# Altium schematic sheet ALL.schdoc
size 274 x 127 mm
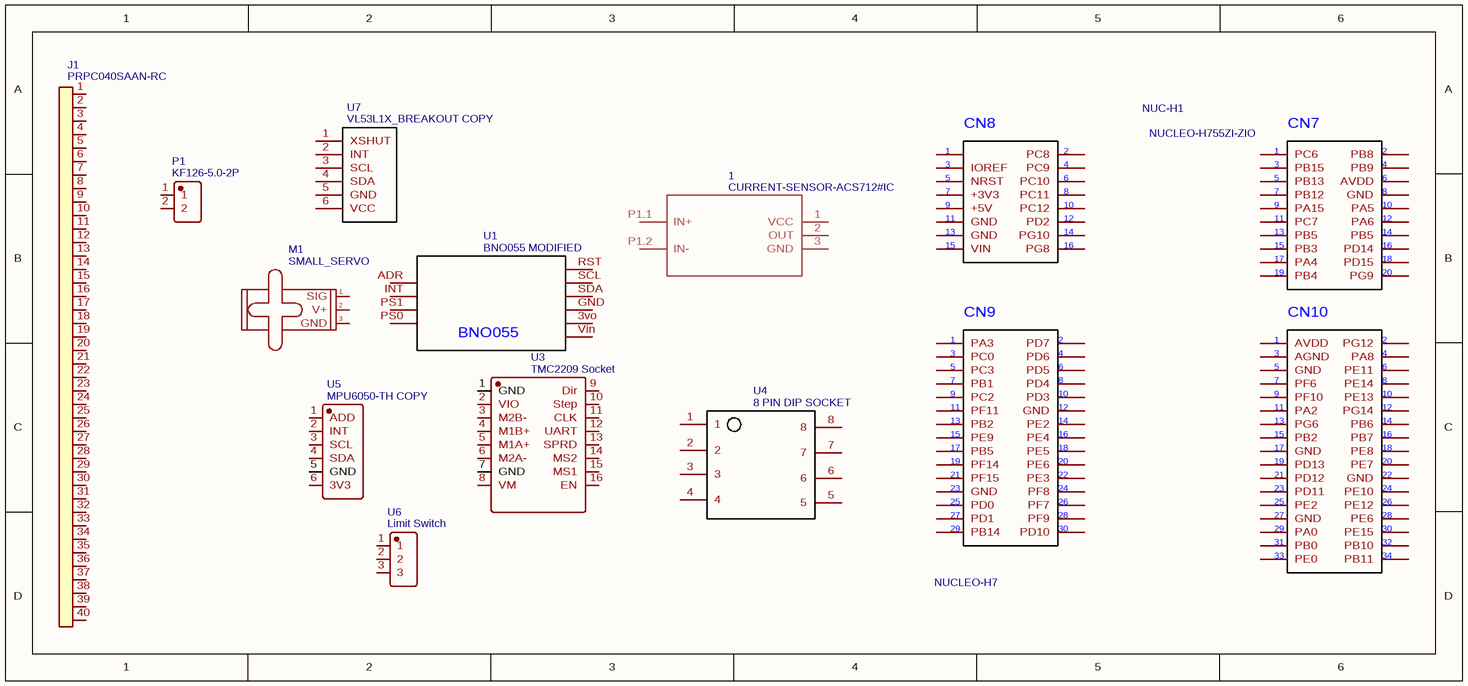
[diagram p0: ALL.schdoc]

## Parts
1  CURRENT-SENSOR-ACS712#IC  [CURRENT-SENSOR-ACS712#IC]
J1  PRPC040SAAN-RC  [PINHEADER_1X40_P2.54_DRILL1MM]
M1  SMALL_SERVO  [1X03]
NUC-H1  NUCLEO-H755ZI-ZIO  [NUCLEO-H7]
P1  KF126-5.0-2P  [CONN-TH_P5.00_KF126-5.0-2P]
U1  BNO055 MODIFIED  [BNO055]
U3  TMC2209 Socket  [COMM-TH_TMC2209SILENTSTEPSTICK]
U4  8 PIN DIP SOCKET  [DIP 8 PIN SOCKET]
U5  MPU6050-TH COPY  [COMM-TH_MPU6050-TH]
U6  Limit Switch  [CONN-TH_3P-P5.00_KF126-5.0-3P]
U7  VL53L1X_BREAKOUT COPY  [VL53L1X_BREAKOUT]

## Nets

Not connected (* = marked no-connect by the designer): 1 1(VCC) 2(OUT) 3(GND) P1.1(IN+) P1.2(IN-); J1 1 2 3 4 5 6 7 8 9 10 11 12 13 14 15 16 17 18 19 20 21 22 23 24 25 26 27 28 29 30 31 32 33 34 35 36 37 38 39 40; M1 1(SIG) 2(V+) 3(GND); NUC-H1 145(PC10) 146(PC8) 147(IOREF) 148(PC9) 149(NRST) 150(PC10) 151(+3V3) 152(PC11) 153(+5V) 154(PC12) 155(GND) 156(PD2) 157(GND) 158(PG10) 159(VIN) 160(PG8) 161(PA3) 162(PD7) 163(PC0) 164(PD6) 165(PC3) 166(PD5) 167(PB1) 168(PD4) 169(PC2) 170(PD3) 171(PF11) 172(GND) 173(PB2) 174(PE2) 175(PE9) 176(PE4) 177(PB5) 178(PE5) 179(PF14) 180(PE6) 181(PF15) 182(PE3) 183(GND) 184(PF8) 185(PD0) 186(PF7) 187(PD1) 188(PF9) 189(PB14) 190(PD10) 191(PC6) 192(PB8) 193(PB15) 194(PB9) 195(PB13) 196(AVDD) 197(PB12) 198(GND) 199(PA15) 200(PA5) 201(PC7) 202(PA6) 203(PB5) 204(PB5) 205(PB3) 206(PD14) 207(PA4) 208(PD15) 209(PB4) 210(PG9) 211(AVDD) 212(PG12) 213(AGND) 214(PA8) 215(GND) 216(PE11) 217(PF6) 218(PE14) 219(PF10) 220(PE13) 221(PA2) 222(PG14) 223(PG6) 224(PB6) 225(PB2) 226(PB7) 227(GND) 228(PE8) 229(PD13) 230(PE7) 231(PD12) 232(GND) 233(PD11) 234(PE10) 235(PE2) 236(PE12) 237(GND) 238(PE6) 239(PA0) 240(PE15) 241(PB0) 242(PB10) 243(PE0) 244(PB11); P1 1 2; U1 3vo ADR GND INT PS0 PS1 RST SCL SDA Vin; U3 1(GND) 2(VIO) 3(M2B-) 4(M1B+) 5(M1A+) 6(M2A-) 7(GND) 8(VM) 9(Dir) 10(Step) 11(CLK) 12(UART) 13(SPRD) 14(MS2) 15(MS1) 16(EN); U4 1 2 3 4 5 6 7 8; U5 1(ADD) 2(INT) 3(SCL) 4(SDA) 5(GND) 6(3V3); U6 1 2 3; U7 1(XSHUT) 2(INT) 3(SCL) 4(SDA) 5(GND) 6(VCC)

## Notes on the sheet
- (in symbol BNO055 MODIFIED) BNO055
- (in symbol NUCLEO-H755ZI-ZIO) CN8; CN7; 1; 2; 3; 4; 5; 6; 7; 8; 9; 10; 11; 12; 13; 14; 15; 16; 17; 18; 19; 20; CN9; CN10; 21; 22; 23; 24; 25; 26; 27; 28; 29; 30; 31; 32; 33; 34; NUCLEO-H7

## Library data of the parts
1 = CURRENT-SENSOR-ACS712#IC: Contributor: arenda1234; spicePre: ?; spiceSymbolName: CURRENT-SENSOR-ACS712#IC
J1 = PRPC040SAAN-RC: Manufacturer: Sullins Connector Solutions; Contributor: morlan.lunsford; spicePre: J; spiceSymbolName: PRPC040SAAN-RC
M1 = SMALL_SERVO: description: Small servo motor; Contributor: hofteboy; spicePre: M; spiceSymbolName: SMALL_SERVO
NUC-H1 = NUCLEO-H755ZI-ZIO: Contributor: zutawin; Package Display: Yes; spicePre: X; Mounted: Yes; Supplier Part: 100x; Supplier: DOLI; spiceSymbolName: NUCLEO-H755ZI-ZIO
P1 = KF126-5.0-2P: Manufacturer: Cixi Kefa Elec; Contributor: LCSC; Supplier: LCSC; Supplier Part: C474900; Manufacturer Part: KF126-5.0-2P; spicePre: P; spiceSymbolName: KF126-5.0-2P
U1 = BNO055 MODIFIED: Contributor: abdussamet28051999; spicePre: U; spiceSymbolName: BNO055 MODIFIED
U3 = TMC2209 Socket: Manufacturer: TRINAMIC; Contributor: plcis; Supplier: LCSC; Supplier Part: C17375345; Manufacturer Part: TMC2209 Socket; JLCPCB Part Class: Extended Part; spicePre: U; spiceSymbolName: TMC2209 Socket
U4 = 8 PIN DIP SOCKET: Contributor: uniqengineeringworks; Supplier: LCSC; spicePre: U; spiceSymbolName: 8 PIN DIP SOCKET
U5 = MPU6050-TH COPY: Manufacturer: null; Contributor: lcsc; Supplier: LCSC; Supplier Part: C9900132629; Manufacturer Part: MPU6050-TH; spicePre: U; spiceSymbolName: MPU6050-TH COPY
U6 = Limit Switch: Manufacturer: Cixi Kefa Elec; Manufacturer Part: KF126-5.0-3P; Contributor: thulasikrishna; Supplier: LCSC; Supplier Part: C474901; JLCPCB Part Class: Extended Part; spicePre: U; spiceSymbolName: KF126-5.0-3P
U7 = VL53L1X_BREAKOUT COPY: Manufacturer Part: VL53L0X Time-of-Flight Distance Sensor VL53L0X; Contributor: freddyka; spicePre: U; spiceSymbolName: VL53L1X_BREAKOUT COPY